# Altium schematic sheet MCU.SchDoc
size A3; SheetNumber: 3; SheetTotal: 5
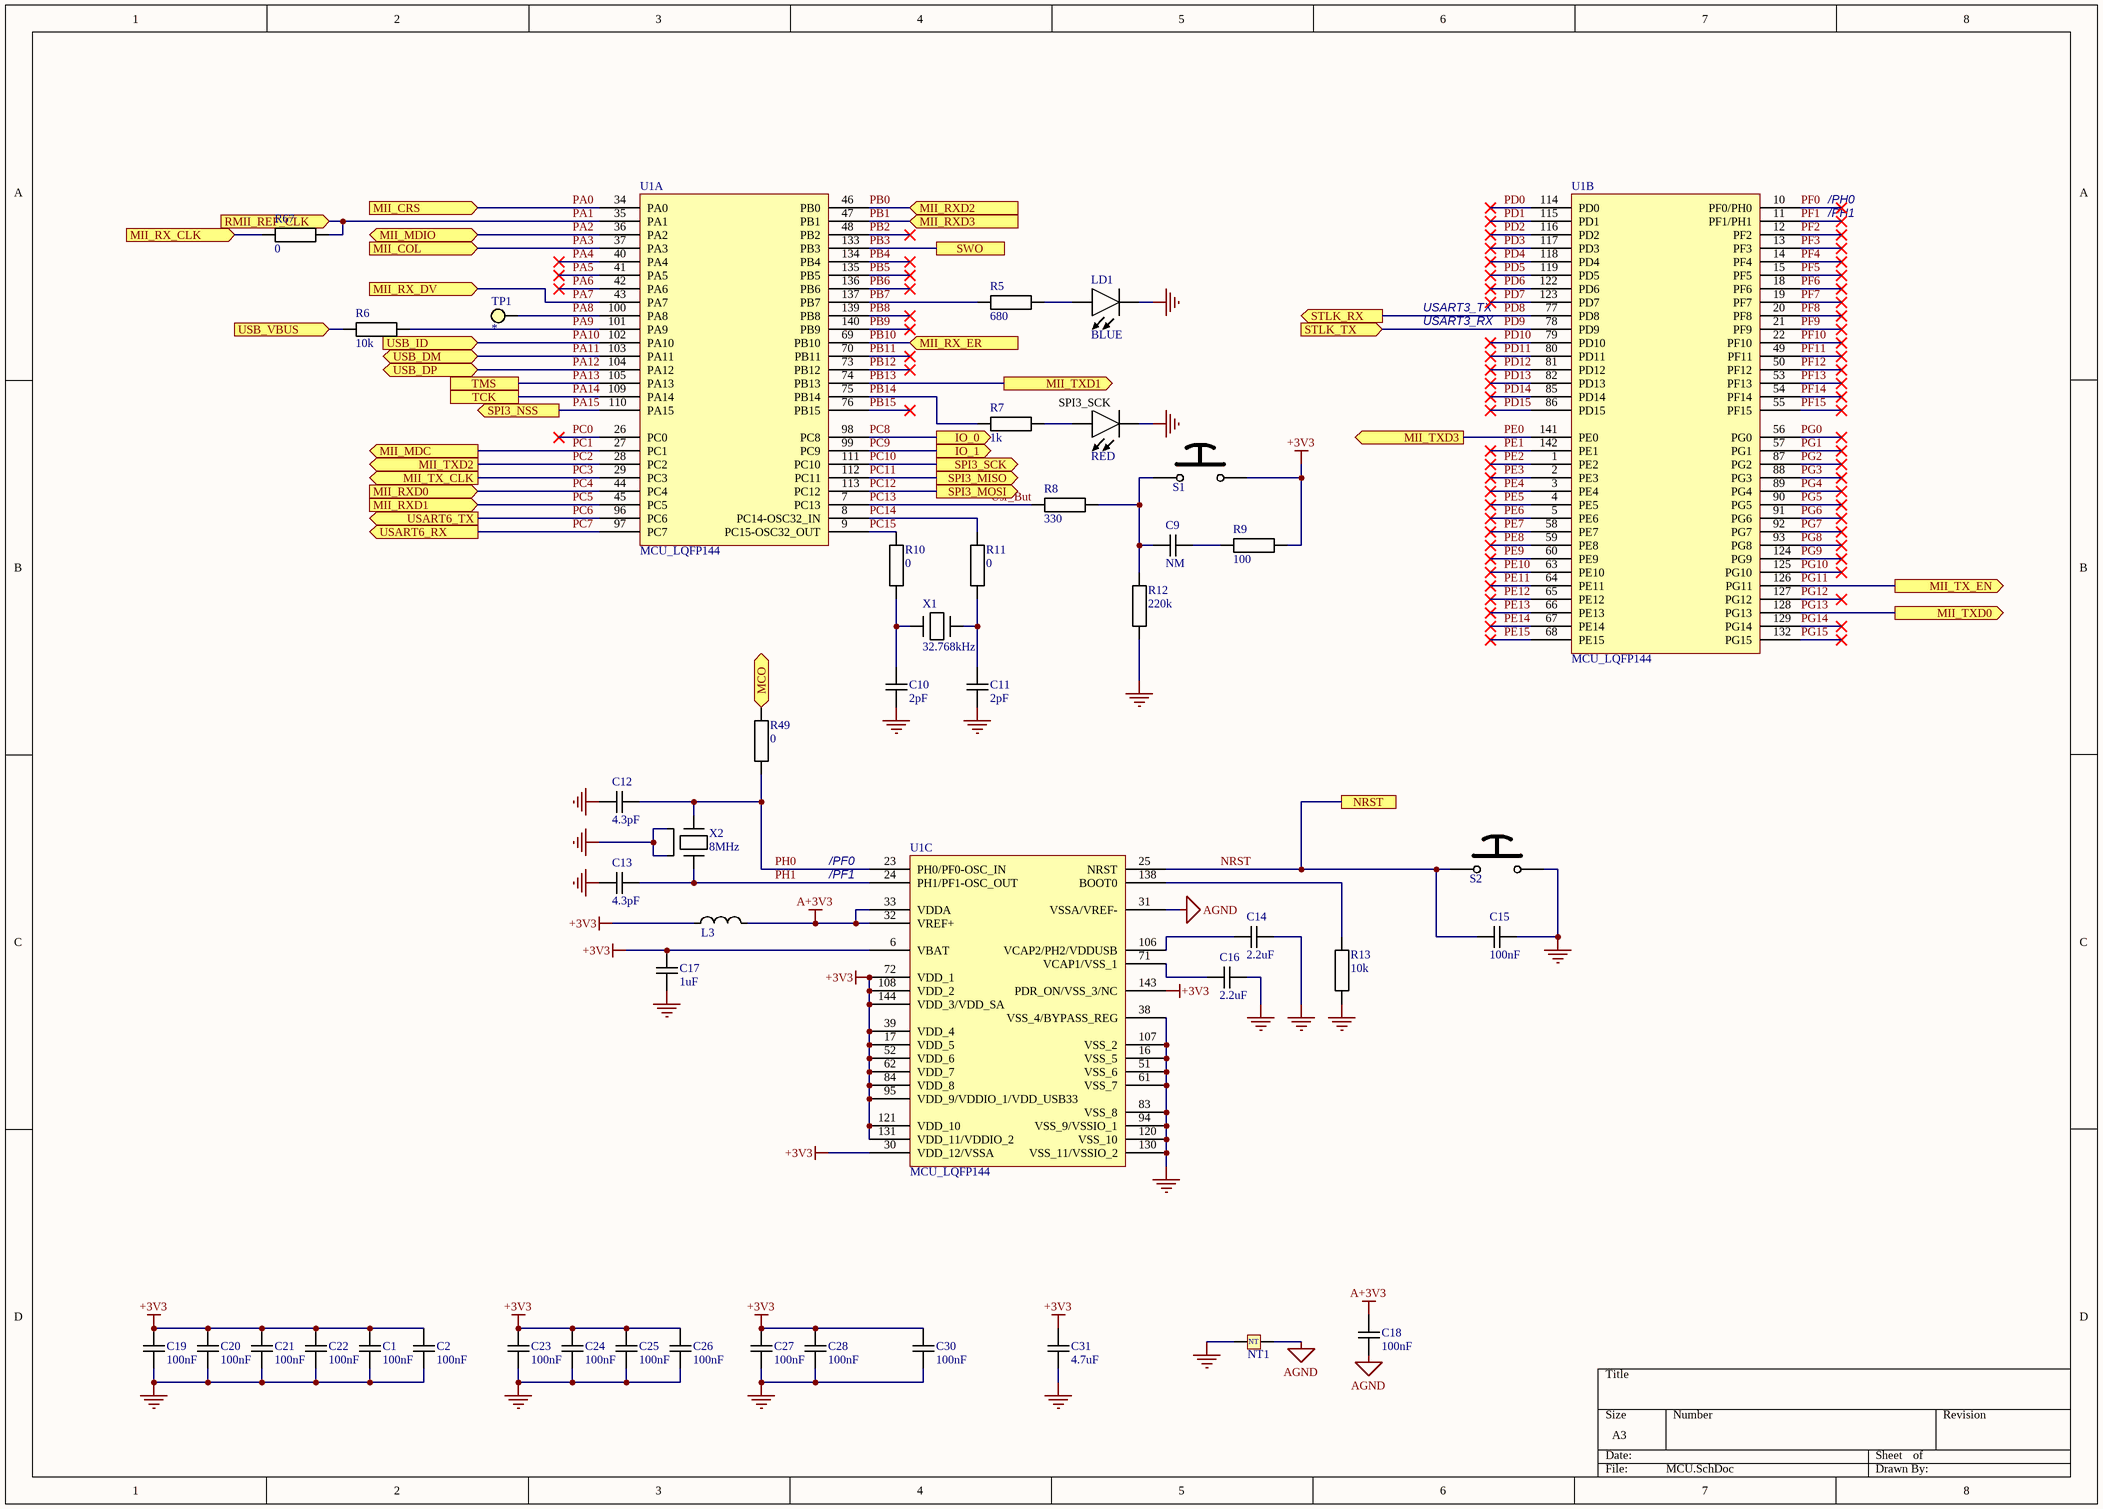
[diagram p0: MCU.SchDoc]

## Parts
C1  100nF  [CAPACITOR 1608 REFLOW]
C2  100nF  [CAPACITOR 1608 REFLOW]
C9  NM  [CAPACITOR 1608 REFLOW]
C10  2pF  [CAPACITOR 1608 REFLOW]
C11  2pF  [CAPACITOR 1608 REFLOW]
C12  4.3pF  [CAPACITOR 1608 REFLOW]
C13  4.3pF  [CAPACITOR 1608 REFLOW]
C14  2.2uF  [CAPACITOR 1608 REFLOW]
C15  100nF  [CAPACITOR 1608 REFLOW]
C16  2.2uF  [CAPACITOR 1608 REFLOW]
C17  1uF  [CAPACITOR 1608 REFLOW]
C18  100nF  [CAPACITOR 1608 REFLOW]
C19  100nF  [CAPACITOR 1608 REFLOW]
C20  100nF  [CAPACITOR 1608 REFLOW]
C21  100nF  [CAPACITOR 1608 REFLOW]
C22  100nF  [CAPACITOR 1608 REFLOW]
C23  100nF  [CAPACITOR 1608 REFLOW]
C24  100nF  [CAPACITOR 1608 REFLOW]
C25  100nF  [CAPACITOR 1608 REFLOW]
C26  100nF  [CAPACITOR 1608 REFLOW]
C27  100nF  [CAPACITOR 1608 REFLOW]
C28  100nF  [CAPACITOR 1608 REFLOW]
C30  100nF  [CAPACITOR 1608 REFLOW]
C31  4.7uF  [CAPACITOR 1608 REFLOW]
L3  *  [INDUCTOR 1608 REFLOW]  (value not drawn)
LD1  BLUE  [LED 1608 REFLOW]
LD2  RED  [LED 1608 REFLOW]
NT1  Net Tie  [NET TIE 1005]  (value not drawn)  (net tie, no BOM)
R5  680  [RESISTOR 1608 REFLOW]
R6  10k  [RESISTOR 1608 REFLOW]
R7  1k  [RESISTOR 1608 REFLOW]
R8  330  [RESISTOR 1608 REFLOW]
R9  100  [RESISTOR 1608 REFLOW]
R10  0  [RESISTOR 1608 REFLOW]
R11  0  [RESISTOR 1608 REFLOW]
R12  220k  [RESISTOR 1608 REFLOW]
R13  10k  [RESISTOR 1608 REFLOW]
R49  0  [RESISTOR 1608 REFLOW]
R67  0  [RESISTOR 1608 REFLOW]
S1  *  [Push Button C2.5X3.0 OMRON B3U-1000P(M)-B]  (value not drawn)
S2  *  [Push Button C2.5X3.0 OMRON B3U-1000P(M)-B]  (value not drawn)
TP1  *  [Pad D0.8]  (no BOM)
U1  MCU_LQFP144  [LQFP144 P0.5 C20.0x20.0 H1.6]  (parts A,B,C of 3)
X1  32.768kHz  [Crystal C2.0x1.2 CTS TF20]
X2  8MHz  [Crystal C2.0x1.6 Abracon ABM11W]

## Ports
IO_0 (out), IO_1 (out), MCO (bidir), MII_COL (in), MII_CRS (in), MII_MDC (out), MII_MDIO (bidir), MII_RX_CLK (in), MII_RX_DV (in), MII_RX_ER (in), MII_RXD0 (in), MII_RXD1 (in), MII_RXD2 (in), MII_RXD3 (in), MII_TX_CLK (out), MII_TX_EN (out), MII_TXD0 (out), MII_TXD1 (out), MII_TXD2 (out), MII_TXD3 (out), NRST, RMII_REF_CLK (in), SPI3_MISO (out), SPI3_MOSI (out), SPI3_NSS (out), SPI3_SCK (out), STLK_RX (out), STLK_TX (in), SWO, TCK, TMS, USART6_RX (out), USART6_TX (out), USB_DM (bidir), USB_DP (bidir), USB_ID (in), USB_VBUS (in)

## Nets
+3V3: C1.1 C2.1 C17.2 C19.1 C20.1 C21.1 C22.1 C23.1 C24.1 C25.1 C26.1 C27.1 C28.1 C30.1 C31.1 L3.1 R9.2 S1.2 U1.6(VBAT) U1.17(VDD_5) U1.30(VDD_12/VSSA) U1.39(VDD_4) U1.52(VDD_6) U1.62(VDD_7) U1.72(VDD_1) U1.84(VDD_8) U1.95(VDD_9/VDDIO_1/VDD_USB33) U1.108(VDD_2) U1.121(VDD_10) U1.131(VDD_11/VDDIO_2) U1.143(PDR_ON/VSS_3/NC) U1.144(VDD_3/VDD_SA)
A+3V3: C18.1 L3.2 U1.32(VREF+) U1.33(VDDA)
AGND: C18.2 NT1.2 U1.31(VSSA/VREF-)
GND: C1.2 C2.2 C10.1 C11.1 C12.2 C13.2 C14.2 C15.1 C16.2 C17.1 C19.2 C20.2 C21.2 C22.2 C23.2 C24.2 C25.2 C26.2 C27.2 C28.2 C30.2 C31.2 LD1.1(C) LD2.1(C) NT1.1 R12.2 R13.2 S2.2 U1.16(VSS_5) U1.38(VSS_4/BYPASS_REG) U1.51(VSS_6) U1.61(VSS_7) U1.83(VSS_8) U1.94(VSS_9/VSSIO_1) U1.107(VSS_2) U1.120(VSS_10) U1.130(VSS_11/VSSIO_2) X2.2 X2.4
MCO: R49.1 ; port MCO
MII_RX_CLK: R67.1 ; port MII_RX_CLK
NRST: C15.2 S2.1 U1.25(NRST) ; port NRST
PA0: U1.34(PA0) ; port MII_CRS
PA1: R67.2 U1.35(PA1) ; port RMII_REF_CLK
PA2: U1.36(PA2) ; port MII_MDIO
PA3: U1.37(PA3) ; port MII_COL
PA4: U1.40(PA4)
PA5: U1.41(PA5)
PA6: U1.42(PA6)
PA7: U1.43(PA7) ; port MII_RX_DV
PA8: TP1.1 U1.100(PA8)
PA9: R6.1 U1.101(PA9)
PA10: U1.102(PA10) ; port USB_ID
PA11: U1.103(PA11) ; port USB_DM
PA12: U1.104(PA12) ; port USB_DP
PA13: U1.105(PA13) ; port TMS
PA14: U1.109(PA14) ; port TCK
PA15: U1.110(PA15) ; port SPI3_NSS
PB0: U1.46(PB0) ; port MII_RXD2
PB1: U1.47(PB1) ; port MII_RXD3
PB2: U1.48(PB2)
PB3: U1.133(PB3) ; port SWO
PB4: U1.134(PB4)
PB5: U1.135(PB5)
PB6: U1.136(PB6)
PB7: R5.2 U1.137(PB7)
PB8: U1.139(PB8)
PB9: U1.140(PB9)
PB10: U1.69(PB10) ; port MII_RX_ER
PB11: U1.70(PB11)
PB12: U1.73(PB12)
PB13: U1.74(PB13) ; port MII_TXD1
PB14: R7.2 U1.75(PB14)
PB15: U1.76(PB15)
PC0: U1.26(PC0)
PC1: U1.27(PC1) ; port MII_MDC
PC2: U1.28(PC2) ; port MII_TXD2
PC3: U1.29(PC3) ; port MII_TX_CLK
PC4: U1.44(PC4) ; port MII_RXD0
PC5: U1.45(PC5) ; port MII_RXD1
PC6: U1.96(PC6) ; port USART6_TX
PC7: U1.97(PC7) ; port USART6_RX
PC8: U1.98(PC8) ; port IO_0
PC9: U1.99(PC9) ; port IO_1
PC10: U1.111(PC10) ; port SPI3_SCK
PC11: U1.112(PC11) ; port SPI3_MISO
PC12: U1.113(PC12) ; port SPI3_MOSI
PC13: R8.1 U1.7(PC13)  [also labelled Usr_But]
PC14: R11.2 U1.8(PC14-OSC32_IN)
PC15: R10.1 U1.9(PC15-OSC32_OUT)
PD0: U1.114(PD0)
PD1: U1.115(PD1)
PD2: U1.116(PD2)
PD3: U1.117(PD3)
PD4: U1.118(PD4)
PD5: U1.119(PD5)
PD6: U1.122(PD6)
PD7: U1.123(PD7)
PD8: U1.77(PD8) ; port STLK_RX
PD9: U1.78(PD9) ; port STLK_TX
PD10: U1.79(PD10)
PD11: U1.80(PD11)
PD12: U1.81(PD12)
PD13: U1.82(PD13)
PD14: U1.85(PD14)
PD15: U1.86(PD15)
PE0: U1.141(PE0) ; port MII_TXD3
PE1: U1.142(PE1)
PE2: U1.1(PE2)
PE3: U1.2(PE3)
PE4: U1.3(PE4)
PE5: U1.4(PE5)
PE6: U1.5(PE6)
PE7: U1.58(PE7)
PE8: U1.59(PE8)
PE9: U1.60(PE9)
PE10: U1.63(PE10)
PE11: U1.64(PE11)
PE12: U1.65(PE12)
PE13: U1.66(PE13)
PE14: U1.67(PE14)
PE15: U1.68(PE15)
PF0: U1.10(PF0/PH0)
PF1: U1.11(PF1/PH1)
PF2: U1.12(PF2)
PF3: U1.13(PF3)
PF4: U1.14(PF4)
PF5: U1.15(PF5)
PF6: U1.18(PF6)
PF7: U1.19(PF7)
PF8: U1.20(PF8)
PF9: U1.21(PF9)
PF10: U1.22(PF10)
PF11: U1.49(PF11)
PF12: U1.50(PF12)
PF13: U1.53(PF13)
PF14: U1.54(PF14)
PF15: U1.55(PF15)
PG0: U1.56(PG0)
PG1: U1.57(PG1)
PG2: U1.87(PG2)
PG3: U1.88(PG3)
PG4: U1.89(PG4)
PG5: U1.90(PG5)
PG6: U1.91(PG6)
PG7: U1.92(PG7)
PG8: U1.93(PG8)
PG9: U1.124(PG9)
PG10: U1.125(PG10)
PG11: U1.126(PG11) ; port MII_TX_EN
PG12: U1.127(PG12)
PG13: U1.128(PG13) ; port MII_TXD0
PG14: U1.129(PG14)
PG15: U1.132(PG15)
PH0: C12.1 R49.2 U1.23(PH0/PF0-OSC_IN) X2.1
PH1: C13.1 U1.24(PH1/PF1-OSC_OUT) X2.3
USB_VBUS: R6.2 ; port USB_VBUS
NetC9_1: C9.1 R9.1
NetC9_2: C9.2 R8.2 R12.1 S1.1
NetC10_2: C10.2 R10.2 X1.1
NetC11_2: C11.2 R11.1 X1.2
NetC14_1: C14.1 U1.106(VCAP2/PH2/VDDUSB)
NetC16_1: C16.1 U1.71(VCAP1/VSS_1)
NetLD1_2: LD1.2(A) R5.1
NetLD2_2: LD2.2(A) R7.1
NetR13_1: R13.1 U1.138(BOOT0)

## Notes on the sheet
- /PH0
- /PH1
- USART3_TX
- USART3_RX
- (near LD2) SPI3_SCK
- /PF0
- /PF1
- (in symbol Net Tie) NT

## Library data of the parts
C1 C2 C9-C28 C30 C31 = Capacitor
  C1 C2 C15 C18-C28 C30: Value: 100nF
  C9: Value: NM
  C10 C11: Value: 2pF
  C12 C13: Value: 4.3pF
  C14 C16: Value: 2.2uF
  C17: Value: 1uF
  C31: Value: 4.7uF
L3 = Inductor: Value: *
LD1 LD2 = LED: LED generic
  LD1: Value: BLUE
  LD2: Value: RED
NT1 = Net Tie: Connection for 2 different NETNAME
R5-R13 R49 R67 = Resistor
  R5: Value: 680
  R6 R13: Value: 10k
  R7: Value: 1k
  R8: Value: 330
  R9: Value: 100
  R10 R11 R49 R67: Value: 0
  R12: Value: 220k
S1 S2 = Push Button 2Pins: Push Button, 2 pins; Value: *
TP1 = Pad: Value: *
X1 = Crystal C2.0x1.2 CTS TF20: Value: 32.768kHz
X2 = Crystal C2.0x1.6 Abracon ABM11W: Value: 8MHz